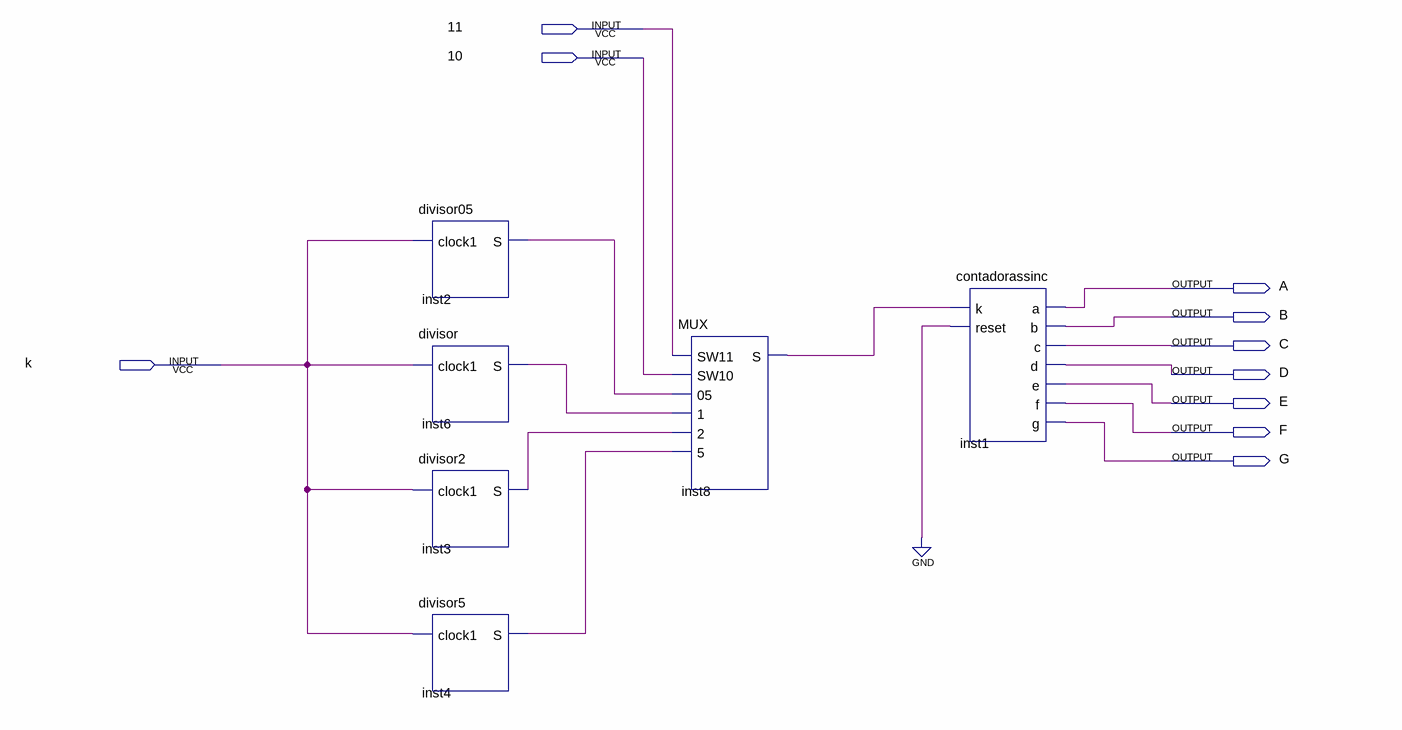
[diagram p0: schematic sheet]
// Quartus schematic contadorautom.bdf as structural Verilog: 6 symbols, 10 pins
module contadorautom (
  input  \11 ,
  input  \10 ,
  input  k,
  output A,
  output B,
  output C,
  output D,
  output E,
  output F,
  output G
);

  wire inst2_s, inst3_s, inst4_s, inst6_s, inst8_s;

  divisor05 inst2 (.clock1(k), .S(inst2_s));
  divisor inst6 (.clock1(k), .S(inst6_s));
  divisor2 inst3 (.clock1(k), .S(inst3_s));
  divisor5 inst4 (.clock1(k), .S(inst4_s));
  MUX inst8 (.SW11(\11 ), .SW10(\10 ), .\05 (inst2_s), .\1 (inst6_s), .\2 (inst3_s), .\5 (inst4_s), .S(inst8_s));
  contadorassinc inst1 (.k(inst8_s), .reset(1'b0), .a(A), .b(B), .c(C), .d(D), .e(E), .f(F), .g(G));
endmodule
